# EAGLE design Review_PCD_1.7 (EAGLE 9.6.2)
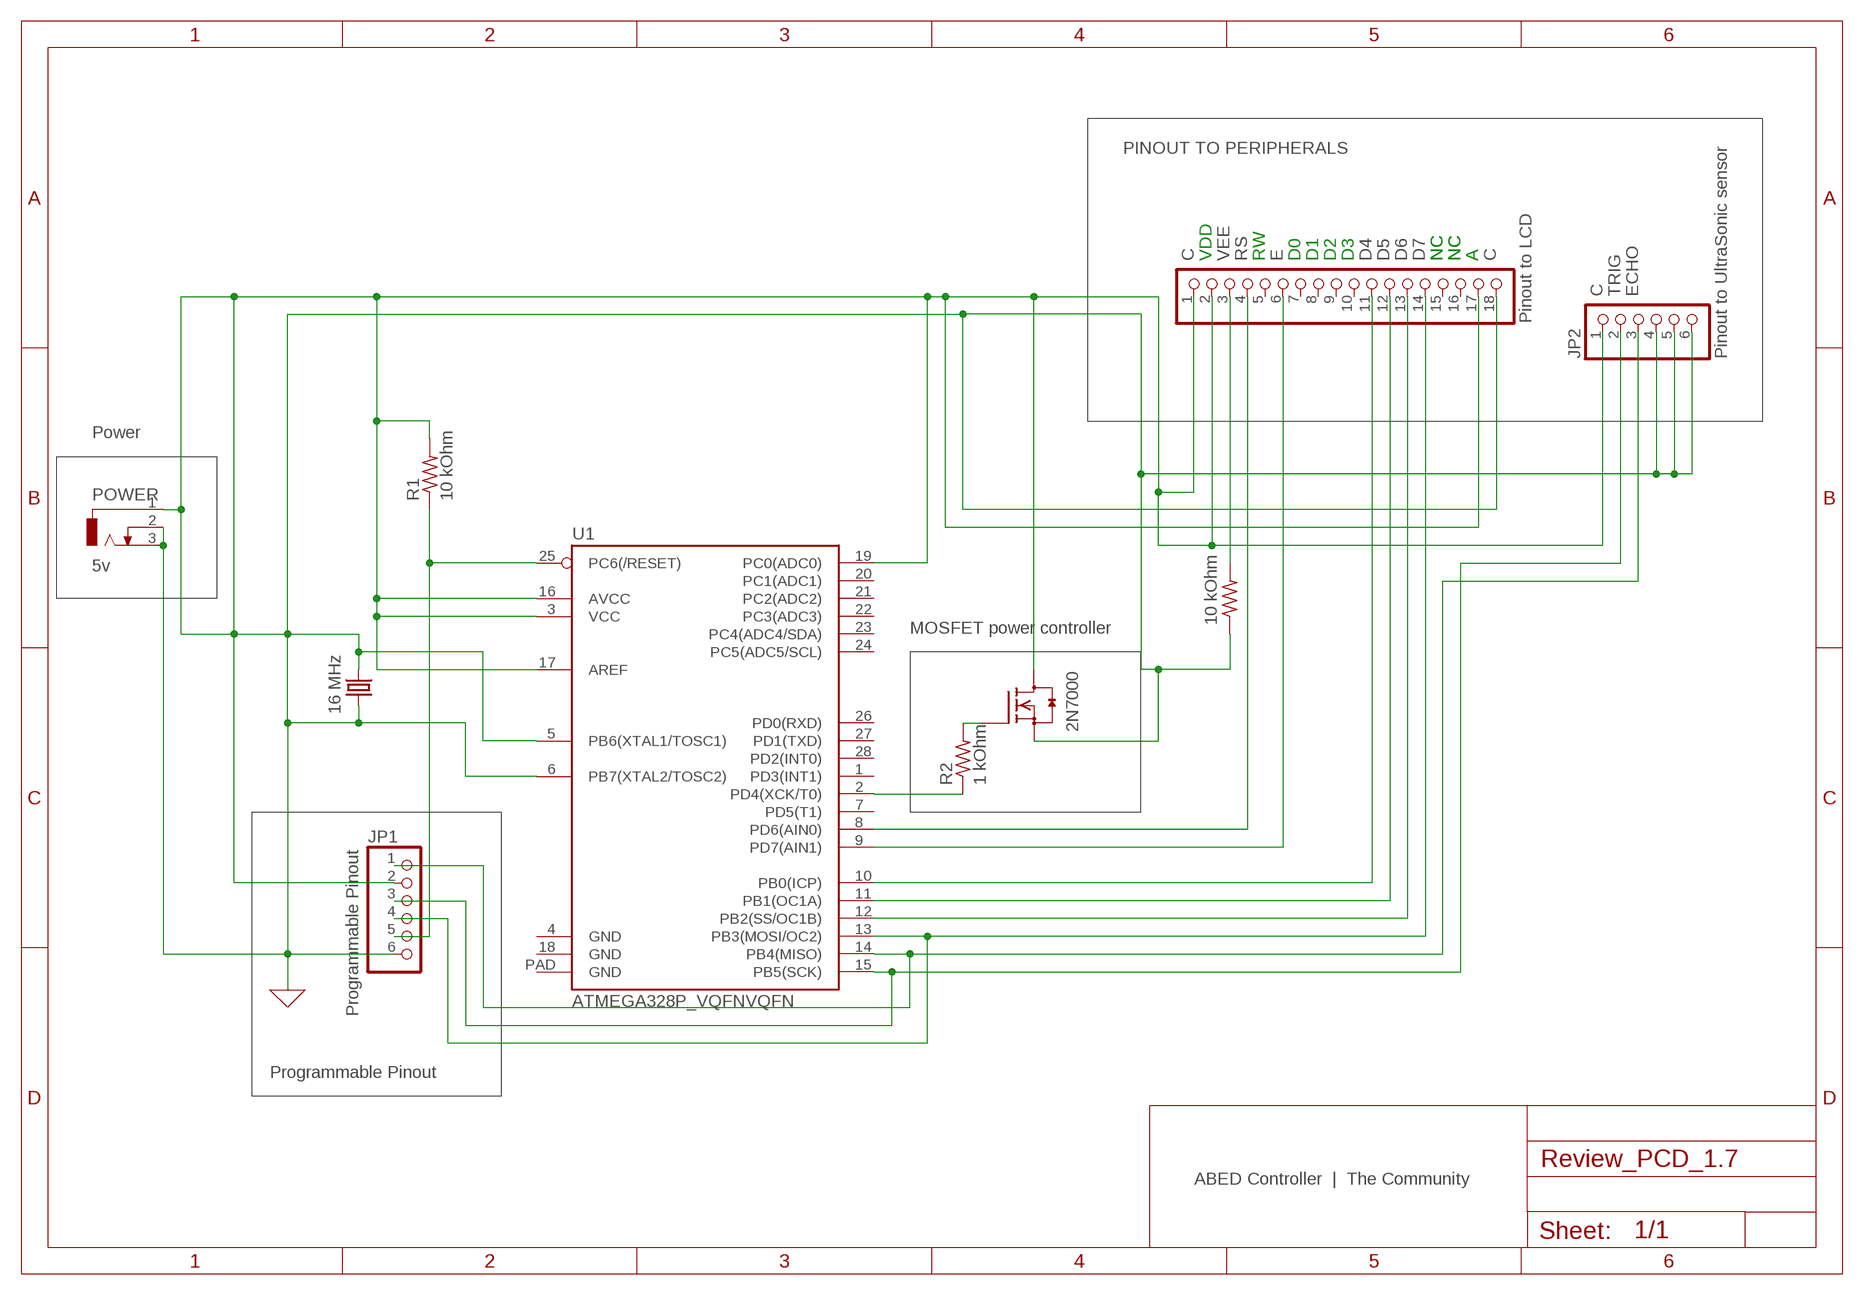
[diagram p0: schematic, sheet 1]

## Parts
JP1  Programmable Pinout  PINHD-1X6-3.5MM  [1X06-3.5MM]
JP2  Pinout to UltraSonic sensor  PINHD-1X6B  [1X06-BIG]
JP3  Pinout to LCD  PINHD-1X18  [1X18]
POWER  5v  DCJ0202  [DCJ0202]
Q1  16 MHz  KX-4  [1.6X1.2]
Q2  2N7000  2N7000KL/BS170KL  [TO92]
R1  10 kOhm  R-US_R2012W  [R2012W]
R2  1 kOhm  R-US_R2012W  [R2012W]
R3  10 kOhm  R-US_R2012W  [R2012W]
U1  ATMEGA328P_VQFNVQFN  [VQFN-28]

## Nets
C: JP1.2 JP1.6 JP2.1 JP2.4 JP2.5 JP2.6 JP3.1 JP3.2 JP3.17 JP3.18 POWER.1 POWER.2 POWER.3 Q1.1 Q1.3 Q2.1(S) Q2.3(D) R1.2 R3.1 U1.3(VCC) U1.5(PB6(XTAL1/TOSC1)) U1.6(PB7(XTAL2/TOSC2)) U1.16(AVCC) U1.17(AREF) U1.19(PC0(ADC0)) ; supply symbol labelled GND
D4: JP3.11 U1.10(PB0(ICP))
D5: JP3.12 U1.11(PB1(OC1A))
D6: JP3.13 U1.12(PB2(SS/OC1B))
D7: JP1.4 JP3.14 U1.13(PB3(MOSI/OC2))
E: JP3.6 U1.9(PD7(AIN1))
ECHO: JP1.1 JP2.3 U1.14(PB4(MISO))
N$1: Q2.2(G) R2.2
N$2: JP1.5 R1.1 U1.25(PC6(/RESET))
N$3: R2.1 U1.2(PD4(XCK/T0))
RS: JP3.4 U1.8(PD6(AIN0))
TRIG: JP1.3 JP2.2 U1.15(PB5(SCK))
VEE: JP3.3 R3.2
Unconnected: JP3.5 JP3.7 JP3.8 JP3.9 JP3.10 JP3.15 JP3.16 U1.1(PD3(INT1)) U1.4(GND) U1.7(PD5(T1)) U1.18(GND) U1.20(PC1(ADC1)) U1.21(PC2(ADC2)) U1.22(PC3(ADC3)) U1.23(PC4(ADC4/SDA)) U1.24(PC5(ADC5/SCL)) U1.26(PD0(RXD)) U1.27(PD1(TXD)) U1.28(PD2(INT0)) U1.PAD(GND)

## Notes on the sheet
- PINOUT TO PERIPHERALS
- VDD | RW | D0 | D1 | D2 | D3 | NC | NC | NC | NC | A
- Power
- MOSFET power controller
- Programmable Pinout
- ABED Controller  |  The Community

## Library data of the parts
JP1 JP2 = adafruit:PINHD-1X6: PIN HEADER
JP3 = adafruit:PINHD-1X18: PIN HEADER
POWER = con-jack:DCJ0202: DC POWER JACK Source: DCJ0202.pdf; OC_FARNELL: unknown; OC_NEWARK: unknown
Q1 = crystal-geyer_V1_0:KX: Quartz Crystals (MHz) SMD: KX - Serie Model Size l/w/h [mm] Frequency Range Frequency Stability Temp. Range [°C] Load Capacitance AECQ 200 availabel Datasheet KX-4 KX-5 KX-6 KX-7 KX-9A KX-9B KX-12A KX-12B KX-13 KX-20 KX-K KX-KS 1.6/1.2/0.3 2.0/1.6/0.45 2.5/2.0/0.55 3.2/2.5/0.8 5.0/3.2/1.0 5.0/3.2/1.1 6.0/3.5/1.1 6.0/3.5/1.0 7.0/5.0 /1.3 11.6/5.5/1.6 12.3/4.5/4.2 12.3/4.5/3.2 24.0 ~ 80.0 MHz 16.0 ~ 80.0 MHz 12.0 ~ 80.0 MHz 8.0 ~ 60.0 MHz 7,68 ~ 300,0 MHz 8,0 ~ 50,0 MHz 8,0 ~ 150,0 MHz 8,0 ~ 50,0 MHz 6,0 ~ 160,0 MHz 3,579 ~ 25,0 MHz 3,579 ~ 70,0 MHz 3,579 ~ 70,0 MHz ±10 … ±50ppm ±10 … ±50ppm ±10 … ±50ppm ±10 … ±50ppm ±10 … ±50ppm ±10 … ±50ppm ±10 … ±50ppm ±10 … ±50ppm ±10 … ±50ppm ±50ppm ±10 … ±50ppm ±10 … ±50ppm (*) -40°C …+85°C (*) -40°C …+125°C (*) -40°C …+125°C (*) -40°C …+125°C (*) -40°C …+105°C (*) -40°C …+105°C (*) -40°C …+125°C (*) -40°C …+105°C (*) -40°C …+105°C (*) -40°C …+105°C (*) -40°C …+85°C (*) -40°C …+85°C 8, 8…16 8, 8…16 10, 8…16 12, 7…20 16, 10…20 16, 10…20 16, 10…20 16, 12…20 16, 12…20 16, 12…20 16, 12…30 16, 12…30 - yes yes yes - - - - - - - - KX-4.pdf <http://www.geyer-electronic.de/uploads/tx_userartikelfrequenz/GEYER-KX-4.pdf> KX-5.pdf <http://www.geyer-electronic.de/uploads/tx_userartikelfrequenz/GEYER-KX-5.pdf> KX-6.pdf <http://www.geyer-electronic.de/uploads/tx_userartikelfrequenz/GEYER-KX-6.pdf> KX-7.pdf <http://www.geyer-electronic.de/uploads/tx_userartikelfrequenz/GEYER-KX-7.pdf> KX-9A.pdf <http://www.geyer-electronic.de/uploads/tx_userartikelfrequenz/GEYER-KX-9A.pdf> KX-9B.pdf <http://www.geyer-electronic.de/uploads/tx_userartikelfrequenz/GEYER-KX-9B.pdf> KX-12A.pdf <http://www.geyer-electronic.de/uploads/tx_userartikelfrequenz/GEYER-KX-12A.pdf> KX-12B.pdf <http://www.geyer-electronic.de/uploads/tx_userartikelfrequenz/GEYER-KX-12B.pdf> KX-13.pdf <http://www.geyer-electronic.de/uploads/tx_userartikelfrequenz/GEYER-KX-13.pdf> KX-20.pdf <http://www.geyer-electronic.de/uploads/tx_userartikelfrequenz/GEYER-KX-20.pdf> KX-K.pdf <http://www.geyer-electronic.de/uploads/tx_userartikelfrequenz/GEYER-KX-K.pdf> KX-KS.pdf <http://www.geyer-electronic.de/uploads/tx_userartikelfrequenz/GEYER-KX-KS.pdf> <http://www.geyer-electronic.de/fileadmin/template/img/logo-geyer-electronic.png> Details see: http://www.geyer-electronic.de/Frequenz-Produkte.9.0.html Created 2016-06-07, Hans Locher 2016 (C) Geyer Quartz Technology KX4,KX5,KX6,KX7,KX9A,KX9B,KX12A,KX12B,KX13,KX20,KXK,KXKS;1612;2016;2520;3225;5032;6035;7050;11655;12345;1,6x1,2;2,0x1,6;2,5x2,0;3,2x2,5;5,0x3,2;6,0x3,5;7,0x5,0;11,6x5,5;12,3x4,5;12,3x4,5;1.6x1.2;2.0x1.6;2.5x2.0;3.2x2.5;5.0x3.2;6.0x3.5;7.0x5.0;11.6x5.5;12.3x4.5;12.3x4.5;; Q1: 16 MHz
Q2 = m-pad-2.1:2N7000KL/BS170KL: Vishay Siliconix 2N7000KL/BS170KL N-Channel 60-V (D-S) MOSFET FEATURES: TrenchFET Power MOSFET ESD Protected: 2000 V APPLICATIONS: Direct Logic-Level Interface: TTL/CMOS Soild State Relays Drivers: Relays, Solenoids, Lamps, Hammers, Displays, Memories, Transistors, etc. Battery Operated Systems Please send any comments to: messi@users.sourceforge.net
R1 = adafruit:R-US_: RESISTOR, American symbol
R2 = adafruit:R-US_: RESISTOR, American symbol; R1: 1 kOhm
R3 = adafruit:R-US_: RESISTOR, American symbol; R1: 10 kOhm
U1 = SparkFun-IC-Microcontroller:ATMEGA328P_VQFN: Atmel 328P QFN part not in catalog

## Board
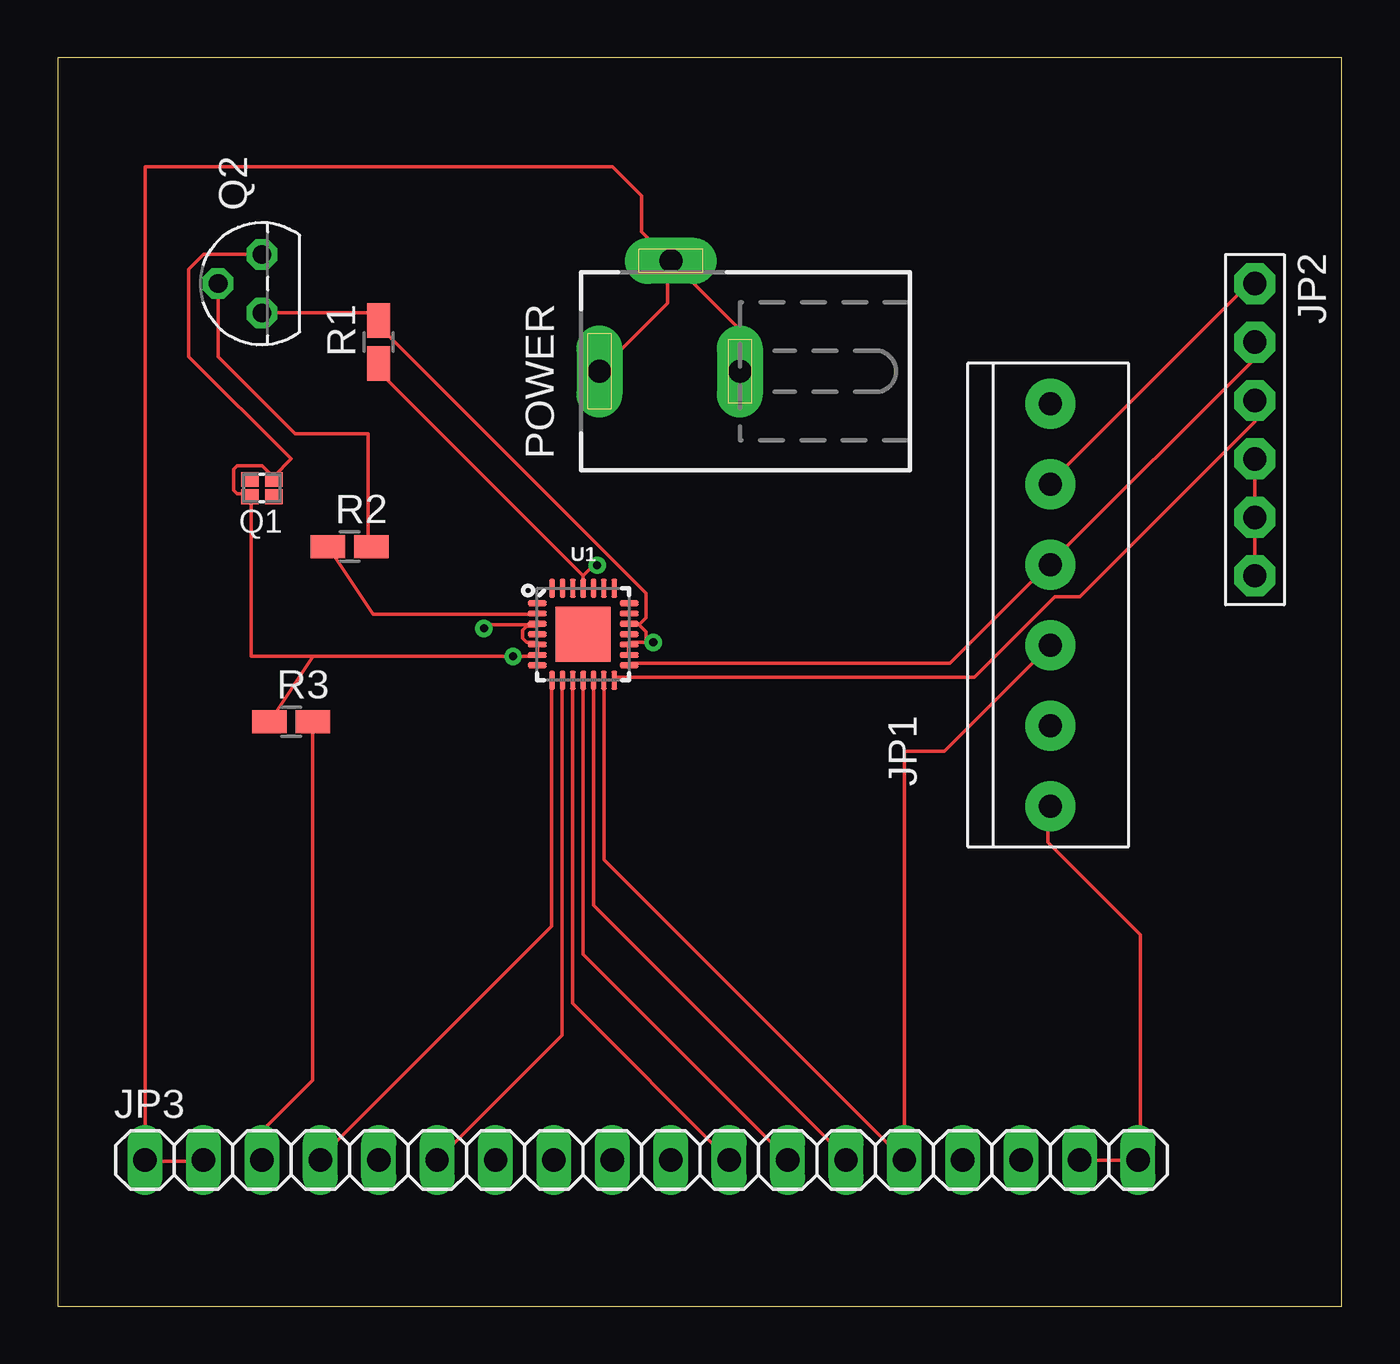
[diagram p1: board, top side]
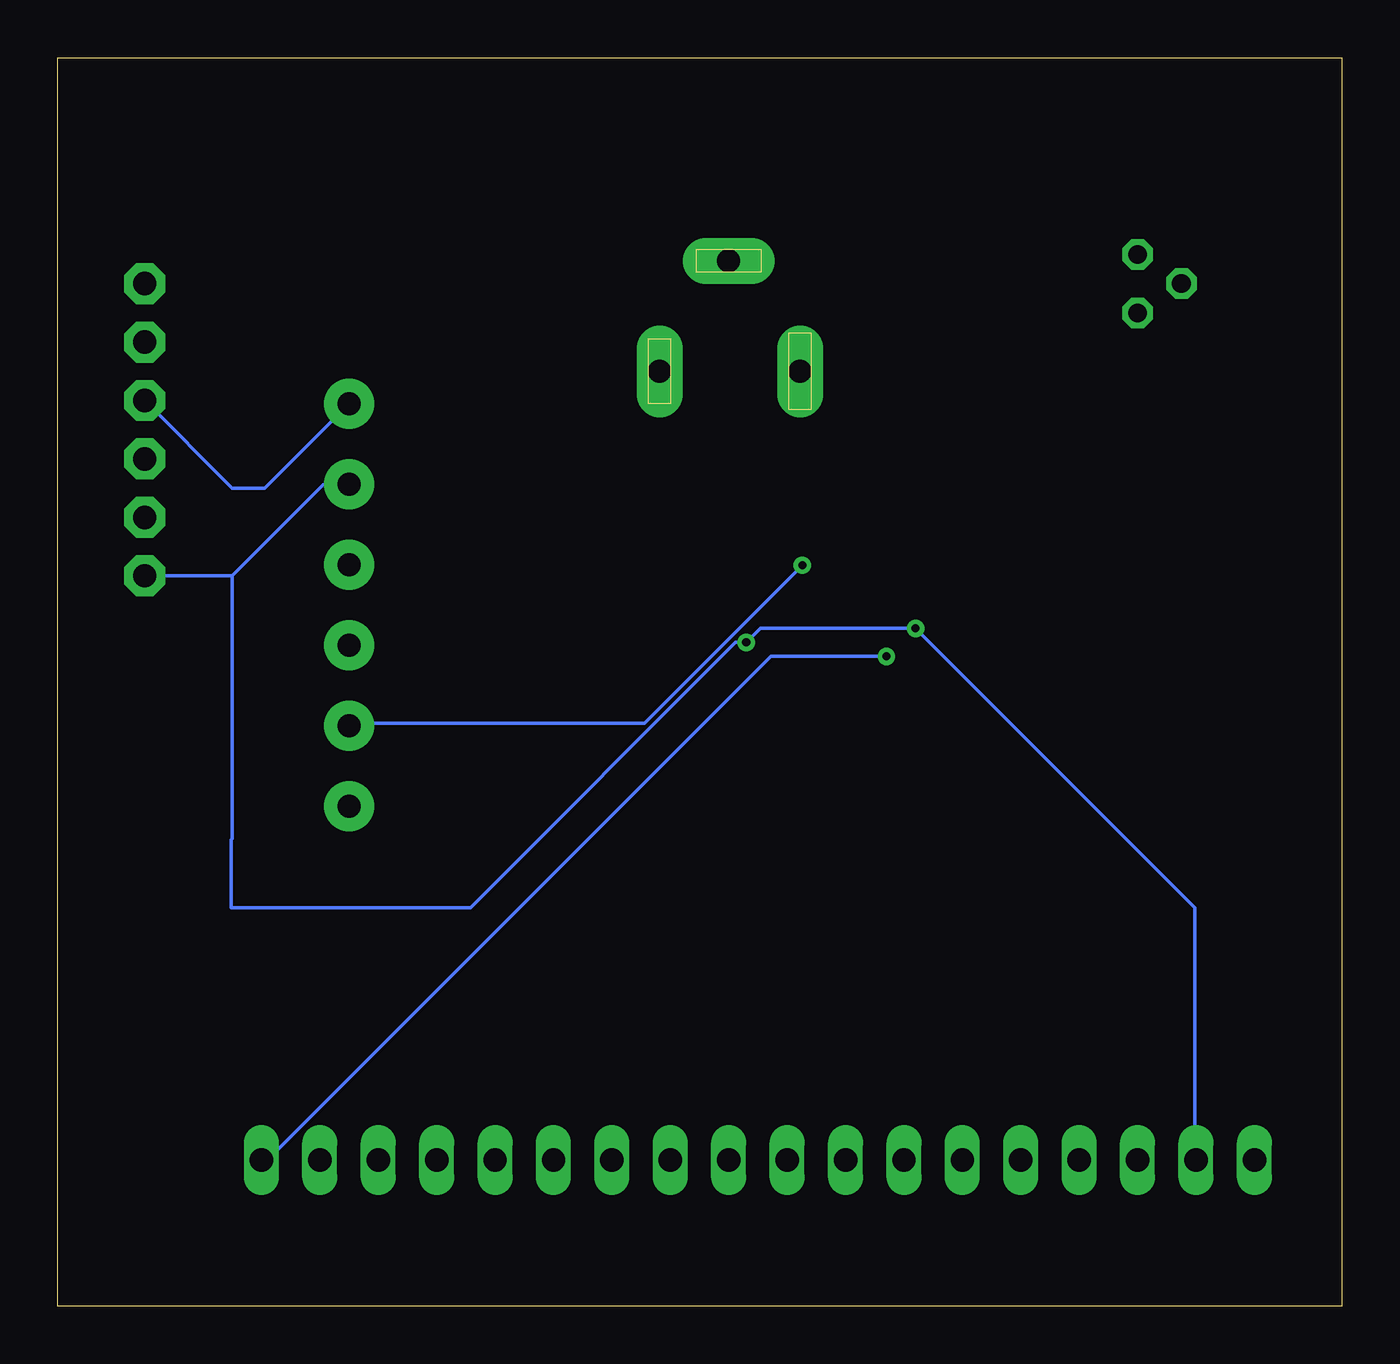
[diagram p2: board, bottom side, seen from below]

Size 55.86 x 54.28 mm. Coordinates in mm from the lower left corner, seen from the top.
Outline: 0,0 55.86,0 55.86,54.28 0,54.28 0,0
Copper layers (1*16): Top 0.035mm / dielectric 0.15mm / Bottom 0.035mm
Design rules "default": minimum track width 6mil, minimum drill 0.35mm, track to track 6mil, track to pad 6mil, pad to pad 6mil, via to via 6mil, smd to smd 6mil, copper to edge 40mil, drill to drill 6mil, minimum pad ring 10mil, minimum via ring 8mil, stop-mask expansion 4mil, vias tented up to drill 0mil, thermal gap 10mil

### Footprints (pad centres in the part's own frame; a part is rotated, then mirrored left to right if it is on the bottom)
1X06-3.5MM = drill 1 pad 2.184: 1 -8.75,0; 2 -5.25,0; 3 -1.75,0; 4 1.75,0; 5 5.25,0; 6 8.75,0
1X06-BIG = drill 1.016 pad 1.778 octagon: 1 -6.35,0; 2 -3.81,0; 3 -1.27,0; 4 1.27,0; 5 3.81,0; 6 6.35,0
1X18 = drill 1.016 long: 1 -21.59,0; 2 -19.05,0; 3 -16.51,0; 4 -13.97,0; 5 -11.43,0; 6 -8.89,0; 7 -6.35,0; 8 -3.81,0; 9 -1.27,0; 10 1.27,0; 11 3.81,0; 12 6.35,0; 13 8.89,0; 14 11.43,0; 15 13.97,0; 16 16.51,0; 17 19.05,0; 18 21.59,0
DCJ0202 = drill 1 pad 2 long: 1 0,3.1; 2 4.8,0; 3 0,-3
1.6X1.2 = smd 0.75 x 0.65: 1 -0.525,-0.375; 2 0.525,-0.375; 3 0.525,0.375; 4 -0.525,0.375
TO92 = drill 0.813 octagon: 1 1.27,0; 2 0,1.905; 3 -1.27,0
R2012W = smd 1.5 x 1: 1 -0.94,0; 2 0.94,0
VQFN-28 = smd 0.82 x 0.24: 1 -2,1.35; 2 -2,0.9; 3 -2,0.45; 4 -2,0; 5 -2,-0.45; 6 -2,-0.9; 7 -2,-1.35; 15 2,-1.35; 16 2,-0.9; 17 2,-0.45; 18 2,0; 19 2,0.45; 20 2,0.9; 21 2,1.35 | smd 0.24 x 0.82: 8 -1.35,-2; 9 -0.9,-2; 10 -0.45,-2; 11 0,-2; 12 0.45,-2; 13 0.9,-2; 14 1.35,-2; 22 1.35,2; 23 0.9,2; 24 0.45,2; 25 0,2; 26 -0.45,2; 27 -0.9,2; 28 -1.35,2 | smd 2.4 x 2.4: PAD 0,0

### Placement (x,y rotation side)
JP1  43.18,30.48 270 top
JP2  52.07,38.1 270 top
JP3  25.4,6.35 0 top
POWER  26.67,40.64 90 top
Q1  8.89,35.56 180 top
Q2  8.89,44.45 90 top
R1  13.97,41.91 90 top
R2  12.7,33.02 0 top
R3  10.16,25.4 0 top
U1  22.86,29.21 0 top

### Tracks (layer width: path | path; a pad name or v marks a point on that pad's centre or on a via)
C  (via drill 0.35)
  Top 0.152: JP1.6 43.08,21.69 43.08,20.17 47.09,16.15 47.09,6.45 JP3.18 JP3.17 | 20.88,28.7 20.88,28.4 U1.6 20.73,28.25 v19.81,28.25 11.11,28.25 | 20.88,28.7 U1.5 | 11.11,28.25 8.43,28.25 8.43,35.15 Q1.3 8.28,35.31 7.82,35.31 7.67,35.46 7.67,36.37 7.82,36.52 8.89,36.52 9.35,36.07 Q1.1 9.41,36.09 10.16,36.83 5.71,41.27 5.71,45.09 6.35,45.72 Q2.1 | 11.11,28.25 R3.1 | JP3.2 6.25,6.3 3.81,6.3 JP3.1 3.81,49.53 24.13,49.53 25.4,48.26 25.4,46.71 26.53,45.58 | U1.16 24.84,28.4 24.84,28.7 U1.17 24.99,28.85 25.6,28.85 | v18.54,29.46 18.69,29.62 20.73,29.62 U1.3 20.76,29.56 20.39,29.56 20.22,29.39 20.22,29.03 20.39,28.86 20.72,28.86 20.88,28.7 | 25.3,29.62 24.99,29.62 U1.19 | 25.3,29.62 25.6,29.31 25.6,28.85 | 25.6,28.85 v25.91,28.85 | 25.3,29.62 25.6,29.92 25.6,30.99 13.97,42.62 R1.2 13.64,43.18 Q2.3 | JP1.2 43.23,35.87 51.76,44.4 51.97,44.4 JP2.1 | 26.53,45.58 POWER.2 29.67,42.44 POWER.3 | POWER.1 26.53,43.6 26.53,45.58 | JP2.4 52.07,34.34 | 52.07,34.34 JP2.5 | JP2.5 JP2.6 | JP2.5 52.12,34.34 52.07,34.34
  Bottom 0.152: v19.81,28.25 24.84,28.25 46.63,6.45 46.94,6.45 JP3.18 | JP3.2 6.4,6.45 6.4,17.32 v18.54,29.46 25.3,29.46 v25.91,28.85 26.37,28.85 37.9,17.32 48.31,17.32 48.31,20.27 48.26,20.32 48.26,31.75 | JP1.2 43.23,35.71 44.3,35.71 48.26,31.75 | 48.26,31.75 JP2.6
D4
  Top 0.152: JP3.11 22.4,13.16 22.4,27.18 U1.10
D5
  Top 0.152: U1.11 22.86,15.29 31.7,6.45 JP3.12
D6
  Top 0.152: U1.12 23.32,27.18 23.32,17.42 34.29,6.45 JP3.13
D7
  Top 0.152: U1.13 23.77,27.18 23.77,19.41 JP3.14 36.83,24.13 38.58,24.13 JP1.4
E
  Top 0.152: JP3.6 21.95,11.79 21.95,27.18 U1.9
ECHO
  Top 0.152: U1.14 24.23,27.33 39.88,27.33 43.38,30.84 44.45,30.84 52.07,38.46 JP2.3
  Bottom 0.152: JP1.1 46.85,35.56 48.26,35.56 JP2.3
N$1
  Top 0.152: R2.2 13.51,33.12 13.51,37.92 10.34,37.92 6.98,41.27 Q2.2
N$2  (via drill 0.35)
  Top 0.152: R1.1 13.97,40.64 22.86,31.75 | 22.86,31.75 23.32,32.21 v23.47,32.21 | 22.86,31.75 U1.25
  Bottom 0.152: v23.47,32.21 30.33,25.35 43.08,25.35 JP1.5
N$3
  Top 0.152: U1.2 20.73,30.07 13.72,30.07 R2.1
RS
  Top 0.152: U1.8 21.49,27.18 21.49,16.51 11.43,6.45 JP3.4
TRIG
  Top 0.152: U1.15 24.99,27.94 38.81,27.94 43.08,32.21 JP1.3 43.23,32.36 52.17,41.3 52.17,41.96 52.12,41.96 JP2.2
VEE
  Top 0.152: R3.2 11.1,9.83 8.89,7.62 JP3.3